# Altium schematic sheet Ethernet.SchDoc
size A3; DocumentNumber: 6; SheetNumber: 6; SheetTotal: 7
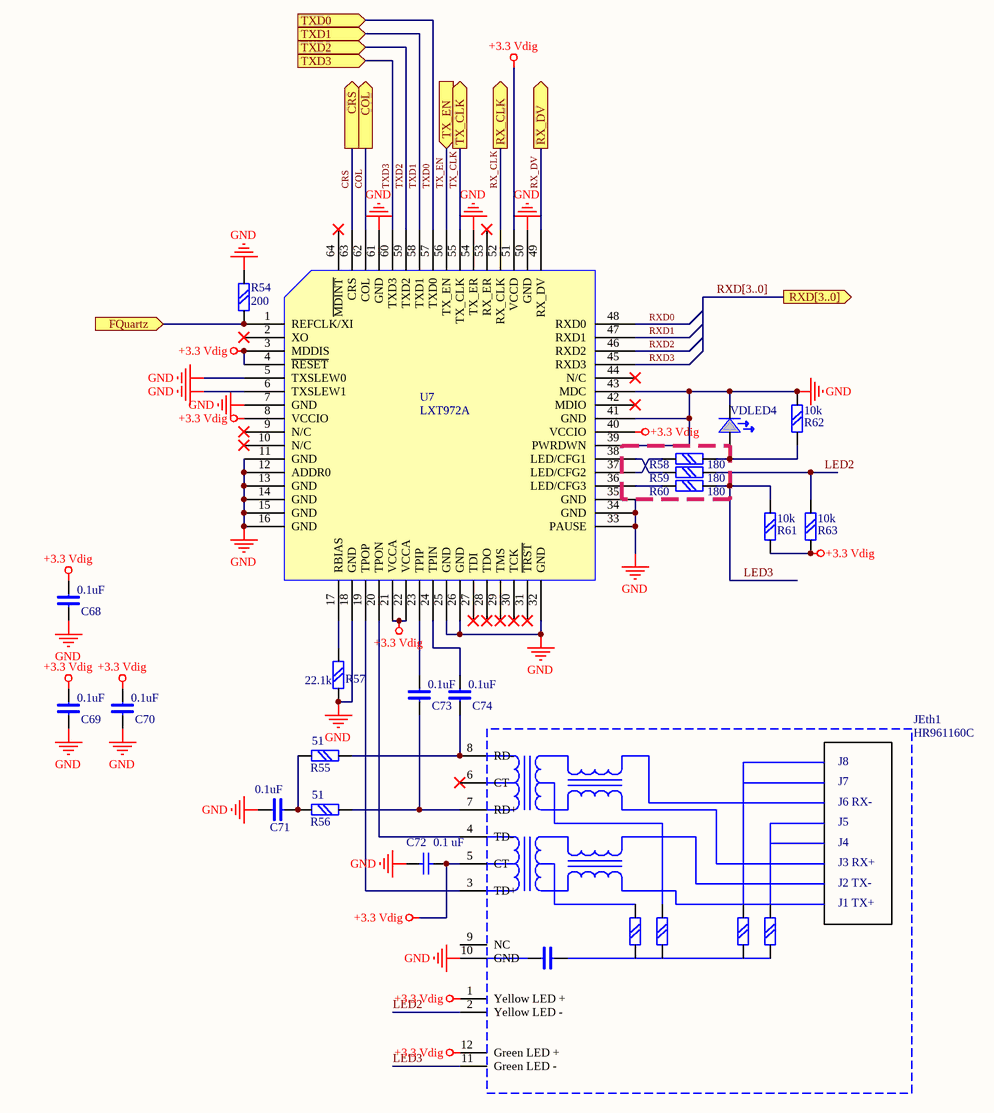
[diagram p0: Ethernet.SchDoc]

## Parts
C68  0.1uF  [chip0603]
C69  0.1uF  [chip0603]
C70  0.1uF  [chip0603]
C71  0.1uF  [chip0603]
C72  value 0.1 uF  [chip0603]  (hidden comment: 0.1uF)
C73  0.1uF  [chip0603]
C74  0.1uF  [chip0603]
JEth1  HR961160C  [HR961160C]
R54  200  [chip0603]
R55  51  [chip0603]
R56  51  [chip0603]
R57  22.1k  [chip0603]
R58  180  [chip0603]
R59  180  [chip0603]
R60  180  [chip0603]
R61  10k  [chip0603]
R62  10k  [chip0603]
R63  10k  [chip0603]
U7  LXT972A  [TQFP64]
VDLED4  LED  [LED0805]  (value not drawn)

## Ports
COL (out), CRS (out), FQuartz (in), RX_CLK (out), RX_DV (out), RXD[3..0] (out), TX_CLK (out), TX_EN (in), TXD0 (in), TXD1 (in), TXD2 (in), TXD3 (in)

## Nets
+3.3 Vdig: C68.2 C69.2 C70.2 C72.2 JEth1.1(Yellow_LED_+) JEth1.5(CT) JEth1.12(Green_LED_+) R61.1 R63.1 U7.3(MDDIS) U7.4(~{RESET}) U7.8(VCCIO) U7.21(VCCA) U7.22(VCCA) U7.40(VCCIO) U7.51(VCCD)
GND: C68.1 C69.1 C70.1 C71.2 C72.1 JEth1.10(GND) R54.2 R57.2 R62.2 U7.5(TXSLEW0) U7.6(TXSLEW1) U7.7(GND) U7.11(GND) U7.12(ADDR0) U7.13(GND) U7.14(GND) U7.15(GND) U7.16(GND) U7.18(GND) U7.25(GND) U7.26(GND) U7.32(GND) U7.33(PAUSE) U7.34(GND) U7.35(GND) U7.39(PWRDWN) U7.41(GND) U7.43(MDC) U7.50(GND) U7.54(TX_ER) U7.61(GND) VDLED4.CATH
COL: U7.62(COL) ; port COL
CRS: U7.63(CRS) ; port CRS
FQuartz: R54.1 U7.1(REFCLK/XI) ; port FQuartz
LED2: JEth1.2(Yellow_LED_-) R59.2 R63.2
LED3: JEth1.11(Green_LED_-) R60.2 R61.2
RX_CLK: U7.52(RX_CLK) ; port RX_CLK
RX_DV: U7.49(RX_DV) ; port RX_DV
RXD0: U7.48(RXD0)
RXD1: U7.47(RXD1)
RXD2: U7.46(RXD2)
RXD3: U7.45(RXD3)
TX_CLK: U7.55(TX_CLK) ; port TX_CLK
TX_EN: U7.56(TX_EN) ; port TX_EN
TXD0: U7.57(TXD0) ; port TXD0
TXD1: U7.58(TXD1) ; port TXD1
TXD2: U7.59(TXD2) ; port TXD2
TXD3: U7.60(TXD3) ; port TXD3
NetC71_1: C71.1 R55.1 R56.2
NetC73_1: C73.1 JEth1.7(RD+) R56.1
NetC73_2: C73.2 U7.23(TPIP)
NetC74_1: C74.1 JEth1.8(RD-) R55.2
NetC74_2: C74.2 U7.24(TPIN)
NetJEth1_3: JEth1.3(TD+) U7.19(TPOP)
NetJEth1_4: JEth1.4(TD-) U7.20(TPON)
NetR57_1: R57.1 U7.17(RBIAS)
NetR58_1: R58.1 U7.37(LED/CFG2)
NetR58_2: R58.2 R62.1 VDLED4.ANOD
NetR59_1: R59.1 U7.38(LED/CFG1)
NetR60_1: R60.1 U7.36(LED/CFG3)

Not connected (* = marked no-connect by the designer): JEth1 6(CT)* 9(NC); U7 2(XO)* 9(N/C)* 10(N/C)* 27(TDI)* 28(TDO)* 29(TMS)* 30(TCK)* 31(~{TRST})* 42(MDIO)* 44(N/C)* 53(RX_ER)* 64(~{MDINT})*

## Buses and harness runs
bus RXD[3..0] = port RXD[3..0]

## Notes on the sheet
- (in symbol HR961160C) J8; J7; J6 RX-; J5; J4; J3 RX+; J2 TX-; J1 TX+

## Library data of the parts
C68-C71 C73 C74 = C: Text Field1: 20; Text Field2: 10
C72 = Cap: Capacitor; Published: 8-Jun-2000; LatestRevisionDate: 17-Jul-2002; LatestRevisionNote: Re-released for DXP Platform.; Publisher: Altium Limited
R54-R63 = R: Text Field1: 20; Text Field2: 20
VDLED4 = AL307: Text Field1: 10; Text Field2: 30